# Altium schematic sheet Power_and_connector.SchDoc
size A2
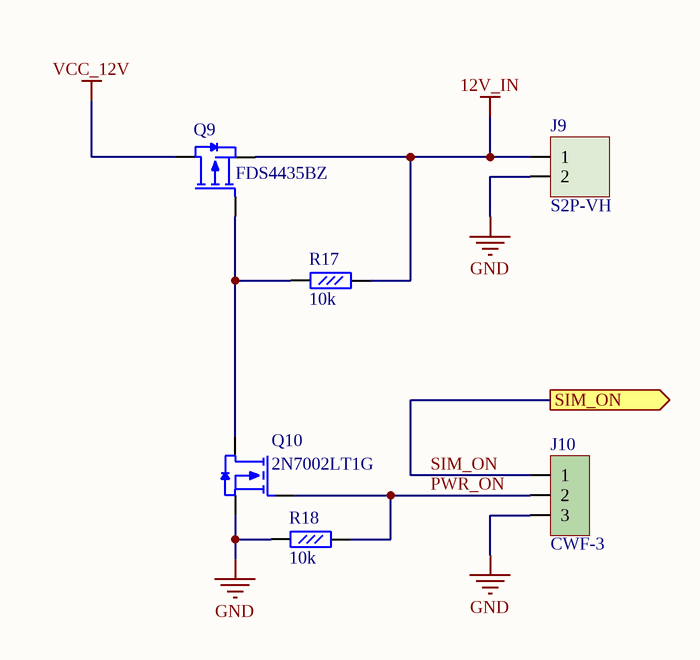
[diagram p0: Power_and_connector.SchDoc]

## Parts
J9  value S2P-VH  [PWL2-02R]  (hidden comment: Разъём (вилка), S2P-VH)
J10  value CWF-3  [CWF-3]  (hidden comment: Разъём (вилка), CWF-3 (DS1069-3 M))
Q9  Транзистор, FDS4435BZ  [SO-8]  (value not drawn)
Q10  PartNumber: 2N7002LT1G  [SOT23]  (hidden comment: Транзистор, 2N7002LT1G)
R17  value 10k  [R0603]  (hidden comment: Резистор SMD, 0.1Вт, 0603, 10кОм, 1%)
R18  value 10k  [R0603]  (hidden comment: Резистор SMD, 0.1Вт, 0603, 10кОм, 1%)

## Ports
SIM_ON (out)

## Nets
12V_IN: J9.1 Q9.1(S) R17.1
GND: J9.2 J10.3 Q10.2(S) R18.2
VCC_12V: Q9.3(D)
PWR_ON: J10.2 Q10.1(G) R18.1
SIM_ON: J10.1 ; port SIM_ON
NetQ9_2: Q9.2(G) Q10.3(D) R17.2

## Library data of the parts
J9 = B2P-VH: 2-pin male header, pitch 3.96 mm; Manufacturer: JST (China); Family: Разъём (вилка); PartNumber: S2P-VH; Assembly: S2P-VH
J10 = CWF-3: 3-pin male though-hole connector, pitch 2.5 mm; Manufacturer: (China); Family: Разъём (вилка); PartNumber: CWF-3 (DS1069-3 M); Assembly: CWF-3
Q9 = FDS4435BZ: P-Shannel 30 V 8A MOSFET; Manufacturer: Fairchild; Family: Транзистор; Package: SO-8; Assembly: FDS4435BZ; PartNumber: FDS4435BZ
Q10 = 2N7002: N-channel OptiMOS™ Small-Signal-Transistor; Manufacturer: Mnf; Family: Транзистор; Package: SOT23; Assembly: 2N7002LT1G
R17 R18 = R0603_0.1: Chip Resistor 0603, 0.1 W; Assembly: 10k_0.1W_1%_0603; Power_assembly: 0.1W; Power: 0.1Вт; Tolerance: 1%; Family: Резистор SMD; Package: 0603; Resistance: 10кОм